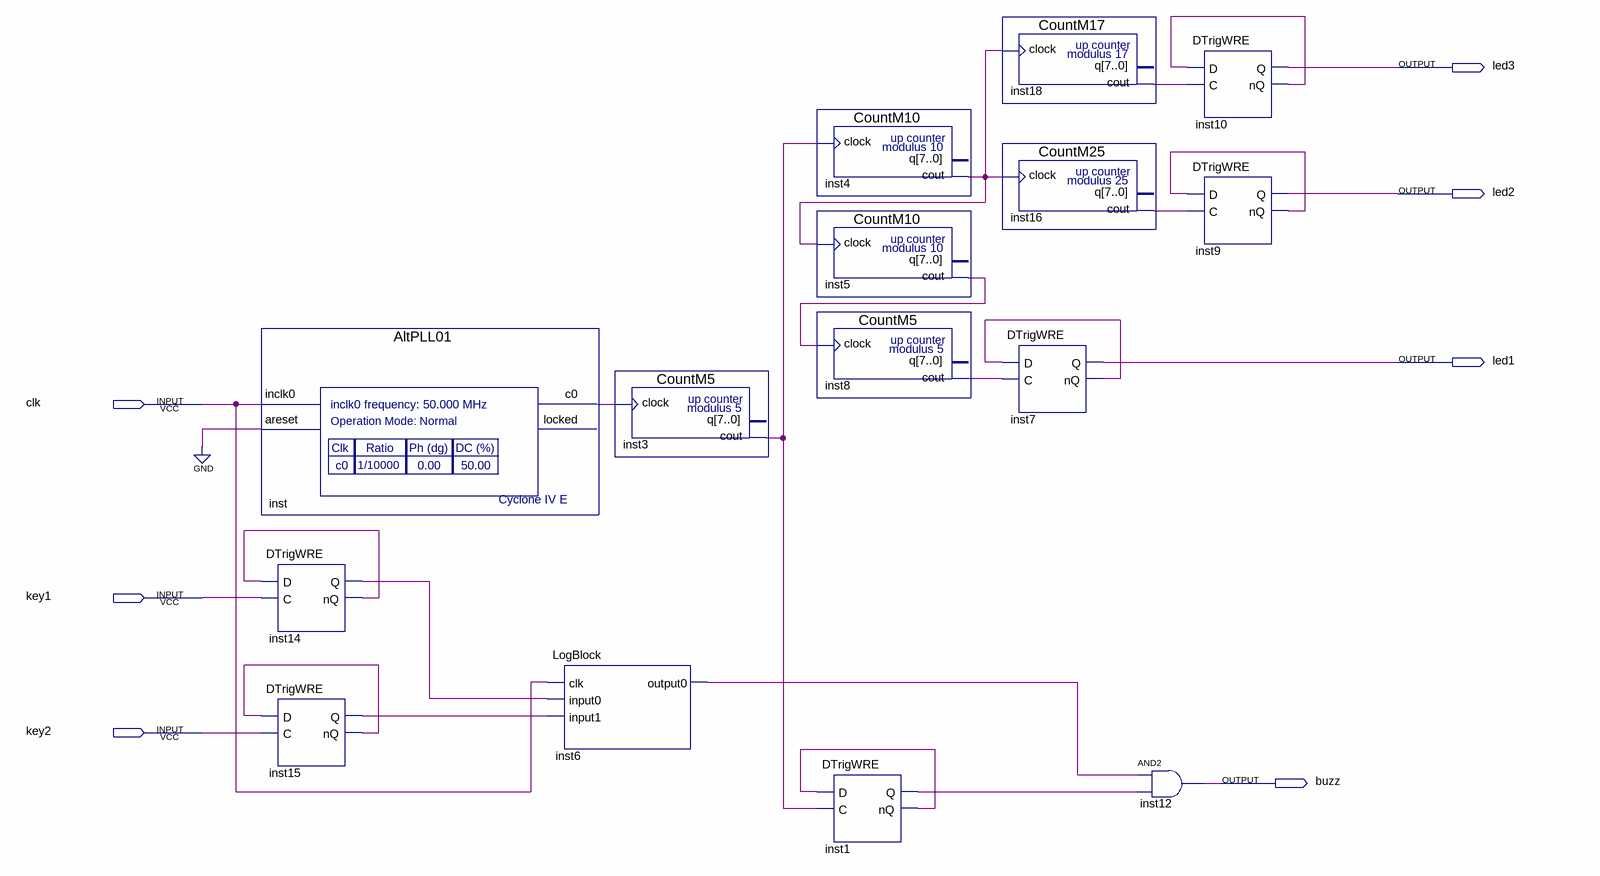
[diagram p0: schematic sheet]
// Quartus schematic IPblock.bdf as structural Verilog: 15 symbols, 7 pins
module IPblock (
  input  clk,
  input  key1,
  input  key2,
  output led3,
  output led2,
  output led1,
  output buzz
);

  wire inst1_nq, inst1_q, inst3_cout, inst4_cout, inst5_cout, inst6_output0, inst7_nq, inst8_cout, inst9_nq,
       inst10_nq, inst14_nq, inst14_q, inst15_nq, inst15_q, inst16_cout, inst18_cout, inst_c0;

  AltPLL01 inst (.inclk0(clk), .areset(1'b0), .c0(inst_c0));  // open: locked
  DTrigWRE inst14 (.D(inst14_nq), .C(key1), .Q(inst14_q), .nQ(inst14_nq));
  DTrigWRE inst15 (.D(inst15_nq), .C(key2), .Q(inst15_q), .nQ(inst15_nq));
  LogBlock inst6 (.clk(clk), .input0(inst14_q), .input1(inst15_q), .output0(inst6_output0));
  CountM5 inst3 (.clock(inst_c0), .cout(inst3_cout));  // open: q
  CountM10 inst4 (.clock(inst3_cout), .cout(inst4_cout));  // open: q
  CountM10 inst5 (.clock(inst4_cout), .cout(inst5_cout));  // open: q
  CountM5 inst8 (.clock(inst5_cout), .cout(inst8_cout));  // open: q
  DTrigWRE inst1 (.D(inst1_nq), .C(inst3_cout), .Q(inst1_q), .nQ(inst1_nq));
  CountM17 inst18 (.clock(inst4_cout), .cout(inst18_cout));  // open: q
  CountM25 inst16 (.clock(inst4_cout), .cout(inst16_cout));  // open: q
  DTrigWRE inst7 (.D(inst7_nq), .C(inst8_cout), .Q(led1), .nQ(inst7_nq));
  DTrigWRE inst10 (.D(inst10_nq), .C(inst18_cout), .Q(led3), .nQ(inst10_nq));
  DTrigWRE inst9 (.D(inst9_nq), .C(inst16_cout), .Q(led2), .nQ(inst9_nq));
  and inst12 (buzz, inst6_output0, inst1_q);
endmodule
